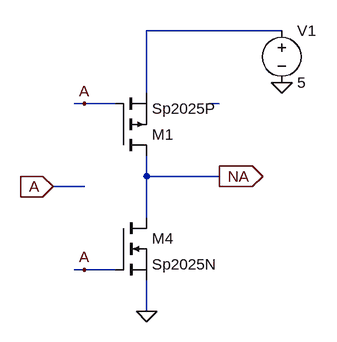
[diagram p0: schematic INVERT.asc]
INVERT.asc, the LTspice schematic file:
Version 4
.lib "../simulation_build/ModelSp2025.txt"
SHEET 1 880 680
WIRE 352 -80 144 -80
WIRE 144 16 144 -80
WIRE 48 32 32 32
WIRE 96 32 48 32
WIRE 256 32 240 32
WIRE 144 144 144 112
WIRE 256 144 144 144
WIRE 48 160 0 160
WIRE 144 208 144 144
WIRE 48 288 32 288
WIRE 96 288 48 288
WIRE 144 352 144 304
FLAG 144 352 0
FLAG 0 160 A
IOPIN 0 160 In
FLAG 48 288 A
FLAG 48 32 A
FLAG 256 144 NA
IOPIN 256 144 Out
FLAG 352 0 0
SYMBOL pmos 96 112 M180
SYMATTR InstName M1
SYMATTR Value Sp2025P
SYMBOL nmos 96 208 R0
SYMATTR InstName M4
SYMATTR Value Sp2025N
SYMBOL voltage 352 -96 R0
SYMATTR InstName V1
SYMATTR Value 5

The netlist it stands for:
* INVERT.asc
M1 NA A N001 N001 Sp2025P
M4 NA A 0 0 Sp2025N
V1 N001 0 5
.model NMOS NMOS
.model PMOS PMOS
.lib standard.mos
.backanno
.end